# EAGLE design OpenOTA (EAGLE 7.2.0)
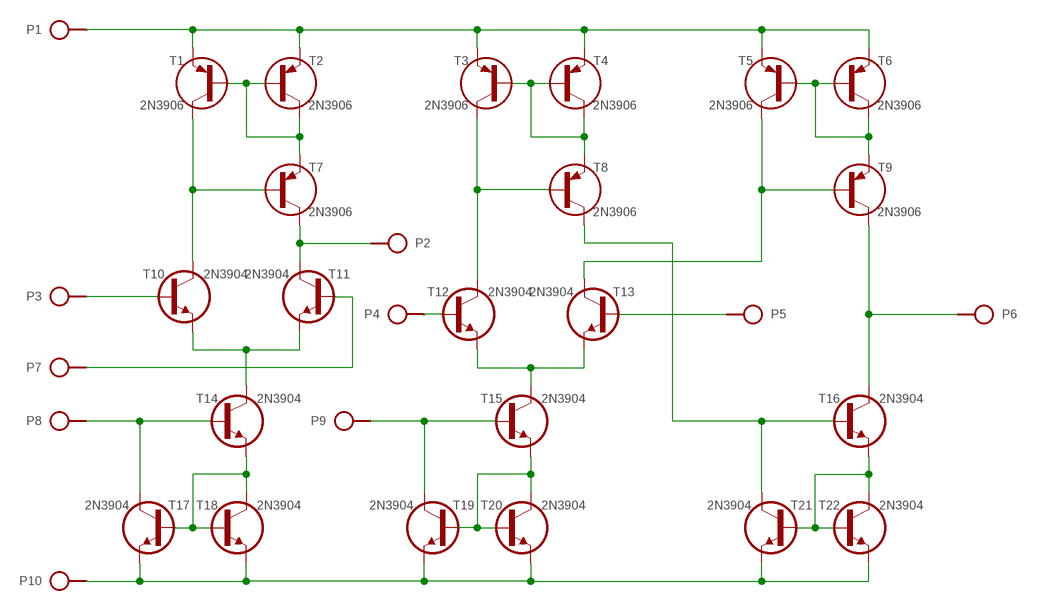
[diagram p0: schematic, sheet 1]

## Parts
P1  SPAD  [SPAD]
P2  SPAD  [SPAD]
P3  SPAD  [SPAD]
P4  SPAD  [SPAD]
P5  SPAD  [SPAD]
P6  SPAD  [SPAD]
P7  SPAD  [SPAD]
P8  SPAD  [SPAD]
P9  SPAD  [SPAD]
P10  SPAD  [SPAD]
T1  2N3906  [TO92]
T2  2N3906  [TO92]
T3  2N3906  [TO92]
T4  2N3906  [TO92]
T5  2N3906  [TO92]
T6  2N3906  [TO92]
T7  2N3906  [TO92]
T8  2N3906  [TO92]
T9  2N3906  [TO92]
T10  2N3904  [TO92]
T11  2N3904  [TO92]
T12  2N3904  [TO92]
T13  2N3904  [TO92]
T14  2N3904  [TO92]
T15  2N3904  [TO92]
T16  2N3904  [TO92]
T17  2N3904  [TO92]
T18  2N3904  [TO92]
T19  2N3904  [TO92]
T20  2N3904  [TO92]
T21  2N3904  [TO92]
T22  2N3904  [TO92]

## Nets
+15: P1.1 T1.1(E) T2.1(E) T3.1(E) T4.1(E) T5.1(E) T6.1(E)
-15: P10.1 T17.1(E) T18.1(E) T19.1(E) T20.1(E) T21.1(E) T22.1(E)
I_A: P8.1 T14.2(B) T17.3(C)
I_B: P9.1 T15.2(B) T19.3(C)
IN_A+: P3.1 T10.2(B)
IN_A-: P7.1 T11.2(B)
IN_B+: P5.1 T13.2(B)
IN_B-: P4.1 T12.2(B)
IO_A: P2.1 T7.3(C) T11.3(C)
N$2: T1.2(B) T2.2(B) T2.3(C) T7.1(E)
N$3: T1.3(C) T7.2(B) T10.3(C)
N$5: T12.1(E) T13.1(E) T15.3(C)
N$6: T3.2(B) T4.2(B) T4.3(C) T8.1(E)
N$7: T3.3(C) T8.2(B) T12.3(C)
N$8: T10.1(E) T11.1(E) T14.3(C)
N$9: T8.3(C) T16.2(B) T21.3(C)
N$10: T5.2(B) T6.2(B) T6.3(C) T9.1(E)
N$11: T5.3(C) T9.2(B) T13.3(C)
N$15: T14.1(E) T17.2(B) T18.2(B) T18.3(C)
N$18: T15.1(E) T19.2(B) T20.2(B) T20.3(C)
N$21: T16.1(E) T21.2(B) T22.2(B) T22.3(C)
OB: P6.1 T9.3(C) T16.3(C)

## Library data of the parts
P1-P10 = pad:SPAD
T1-T9 = t:2N3906
T10-T22 = t:2N3904

## Board
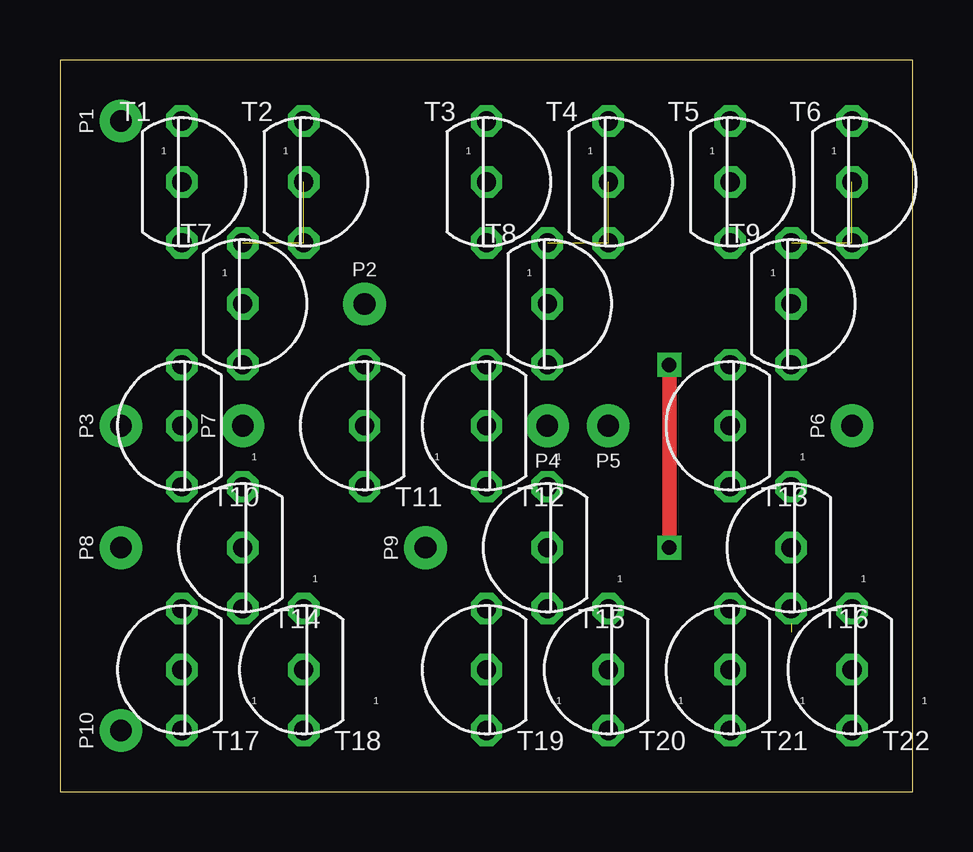
[diagram p1: board, top side]
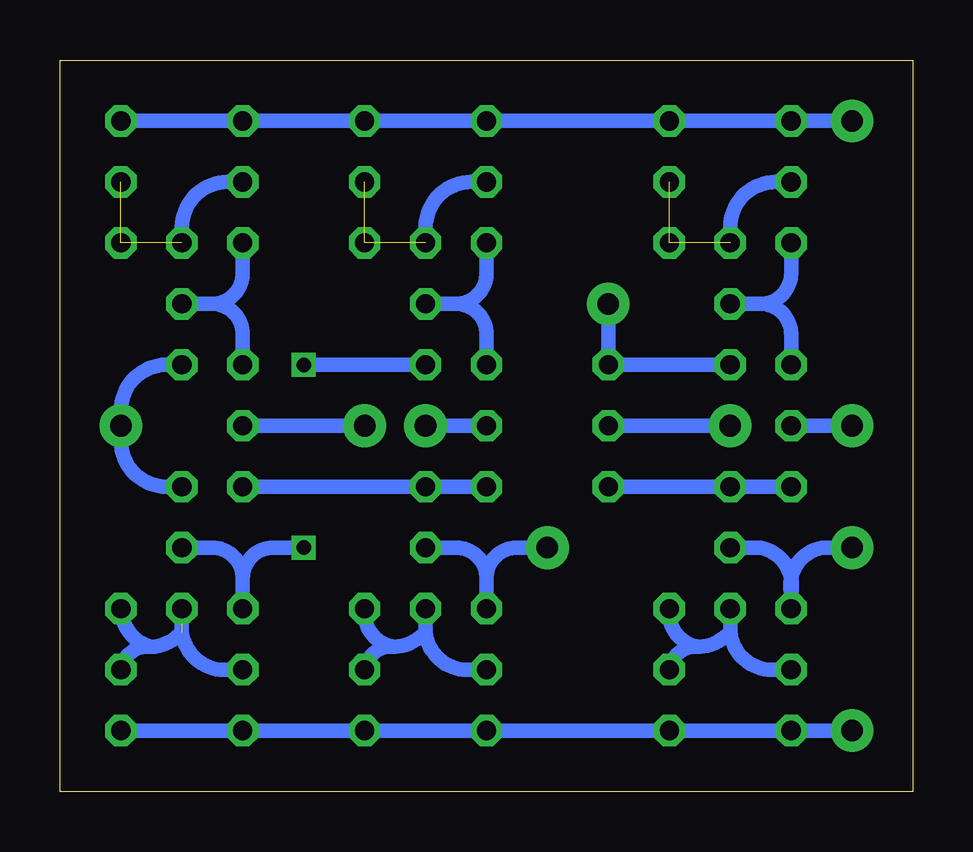
[diagram p2: board, bottom side, seen from below]

Size 35.56 x 30.48 mm. Coordinates in mm from the lower left corner, seen from the top.
Outline: 0,0 35.56,0 35.56,30.48 0,30.48 0,0
Copper layers (1*16): Top 0.035mm / dielectric 1.5mm / Bottom 0.035mm
Design rules "default": minimum track width 10mil, minimum drill 24mil, track to track 8mil, track to pad 8mil, pad to pad 8mil, via to via 8mil, smd to smd 8mil, copper to edge 40mil, drill to drill 8mil, minimum pad ring 10mil, minimum via ring 8mil, stop-mask expansion 4mil, vias tented up to drill 0mil, thermal gap 10mil

### Footprints (pad centres in the part's own frame; a part is rotated, then mirrored left to right if it is on the bottom)
SPAD = drill 0.9 pad 1.778: 1 0,0
TO92 = drill 0.8 octagon: 1 0,2.54; 2 0,0; 3 0,-2.54

### Placement (x,y rotation side)
P1  2.54,27.94 0 top
P2  12.7,20.32 270 top
P3  2.54,15.24 0 top
P4  20.32,15.24 90 top
P5  22.86,15.24 90 top
P6  33.02,15.24 0 top
P7  7.62,15.24 0 top
P8  2.54,10.16 0 top
P9  15.24,10.16 0 top
P10  2.54,2.54 0 top
T1  5.08,25.4 0 top
T2  10.16,25.4 0 top
T3  17.78,25.4 0 top
T4  22.86,25.4 0 top
T5  27.94,25.4 0 top
T6  33.02,25.4 0 top
T7  7.62,20.32 0 top
T8  20.32,20.32 0 top
T9  30.48,20.32 0 top
T10  5.08,15.24 180 top
T11  12.7,15.24 180 top
T12  17.78,15.24 180 top
T13  27.94,15.24 180 top
T14  7.62,10.16 180 top
T15  20.32,10.16 180 top
T16  30.48,10.16 180 top
T17  5.08,5.08 180 top
T18  10.16,5.08 180 top
T19  17.78,5.08 180 top
T20  22.86,5.08 180 top
T21  27.94,5.08 180 top
T22  33.02,5.08 180 top

### Tracks (layer width: path | path; a pad name or v marks a point on that pad's centre or on a via)
+15
  Bottom 0.61: T6.1 T5.1 T4.1 T3.1 T2.1 T1.1 P1.1
-15
  Bottom 0.61: T22.1 T21.1 T20.1 T19.1 T18.1 T17.1 P10.1
I_A
  Bottom 0.61: P8.1 3.81,10.16 arc-90 5.08,8.26 | T17.3 5.08,8.26 | 5.08,8.26 arc-90 6.35,10.16 T14.2
I_B
  Bottom 0.61: T15.2 19.05,10.16 arc90 17.78,8.89 | T19.3 17.78,8.89 | 17.78,8.89 arc90 16.51,10.16 P9.1
IN_A+
  Bottom 0.61: P3.1 T10.2
IN_A-
  Bottom 0.61: P7.1 T11.2
IN_B+
  Bottom 0.61: P5.1 T13.2
IN_B-
  Bottom 0.61: P4.1 T12.2
IO_A
  Bottom 0.61: T7.3 T11.3 P2.1
N$2  (2 unrouted)
  Bottom 0.61: T7.1 7.62,23.5 arc90 5.71,25.4 T1.2
N$3
  Bottom 0.61: T1.3 5.08,21.59 arc90 6.35,20.32 | T7.2 6.35,20.32 | 6.35,20.32 arc90 5.08,19.05 T10.3
N$5
  Bottom 0.61: T12.1 T15.3 T13.1
N$6  (2 unrouted)
  Bottom 0.61: T8.1 20.32,23.5 arc90 18.41,25.4 T3.2
N$7
  Bottom 0.61: T3.3 17.78,21.59 arc90 19.05,20.32 | T8.2 19.05,20.32 | 19.05,20.32 arc90 17.78,19.05 T12.3
N$8
  Bottom 0.61: T10.1 T14.3 T11.1
N$9  (via drill 0.6)
  Top 0.61: v25.4,10.16 v25.4,17.78
  Bottom 0.61: v25.4,17.78 T8.3 | T16.2 29.21,10.16 arc90 27.94,8.89 | T21.3 27.94,8.89 | 27.94,8.89 arc90 26.67,10.16 v25.4,10.16
N$10  (2 unrouted)
  Bottom 0.61: T9.1 30.48,23.5 arc90 28.57,25.4 T5.2
N$11
  Bottom 0.61: T5.3 27.94,21.59 arc90 29.21,20.32 | T9.2 29.21,20.32 | 29.21,20.32 arc90 27.94,19.05 T13.3
N$15
  Bottom 0.61: T17.2 5.71,5.08 arc90 7.62,6.66 | T18.2 arc90 8.89,6.03 | T18.3 arc-90 8.89,6.03 | 7.62,6.66 T14.1 | 8.89,6.03 arc-45 7.62,6.66
N$18
  Bottom 0.61: T19.2 18.41,5.08 arc90 20.32,6.66 | T20.3 arc-90 21.59,6.03 | T20.2 arc90 21.59,6.03 | 21.59,6.03 arc-45 20.32,6.66 | 20.32,6.66 T15.1
N$21  (1 unrouted)
  Bottom 0.61: T21.2 28.89,5.08 | 28.89,5.08 arc90 30.48,7 | T22.2 arc90 31.75,6.03 | T22.3 arc-75 31.75,6.03 | 30.48,7 arc-90 28.89,5.08 | 31.75,6.03 arc-45 30.48,6.64 30.48,7 | 30.48,7 T16.1
OB
  Bottom 0.61: T16.3 31.11,12.7 arc90 33.02,14.61 P6.1 33.02,15.88 arc90 31.11,17.78 T9.3